# EAGLE design sss (EAGLE 7.3.0)
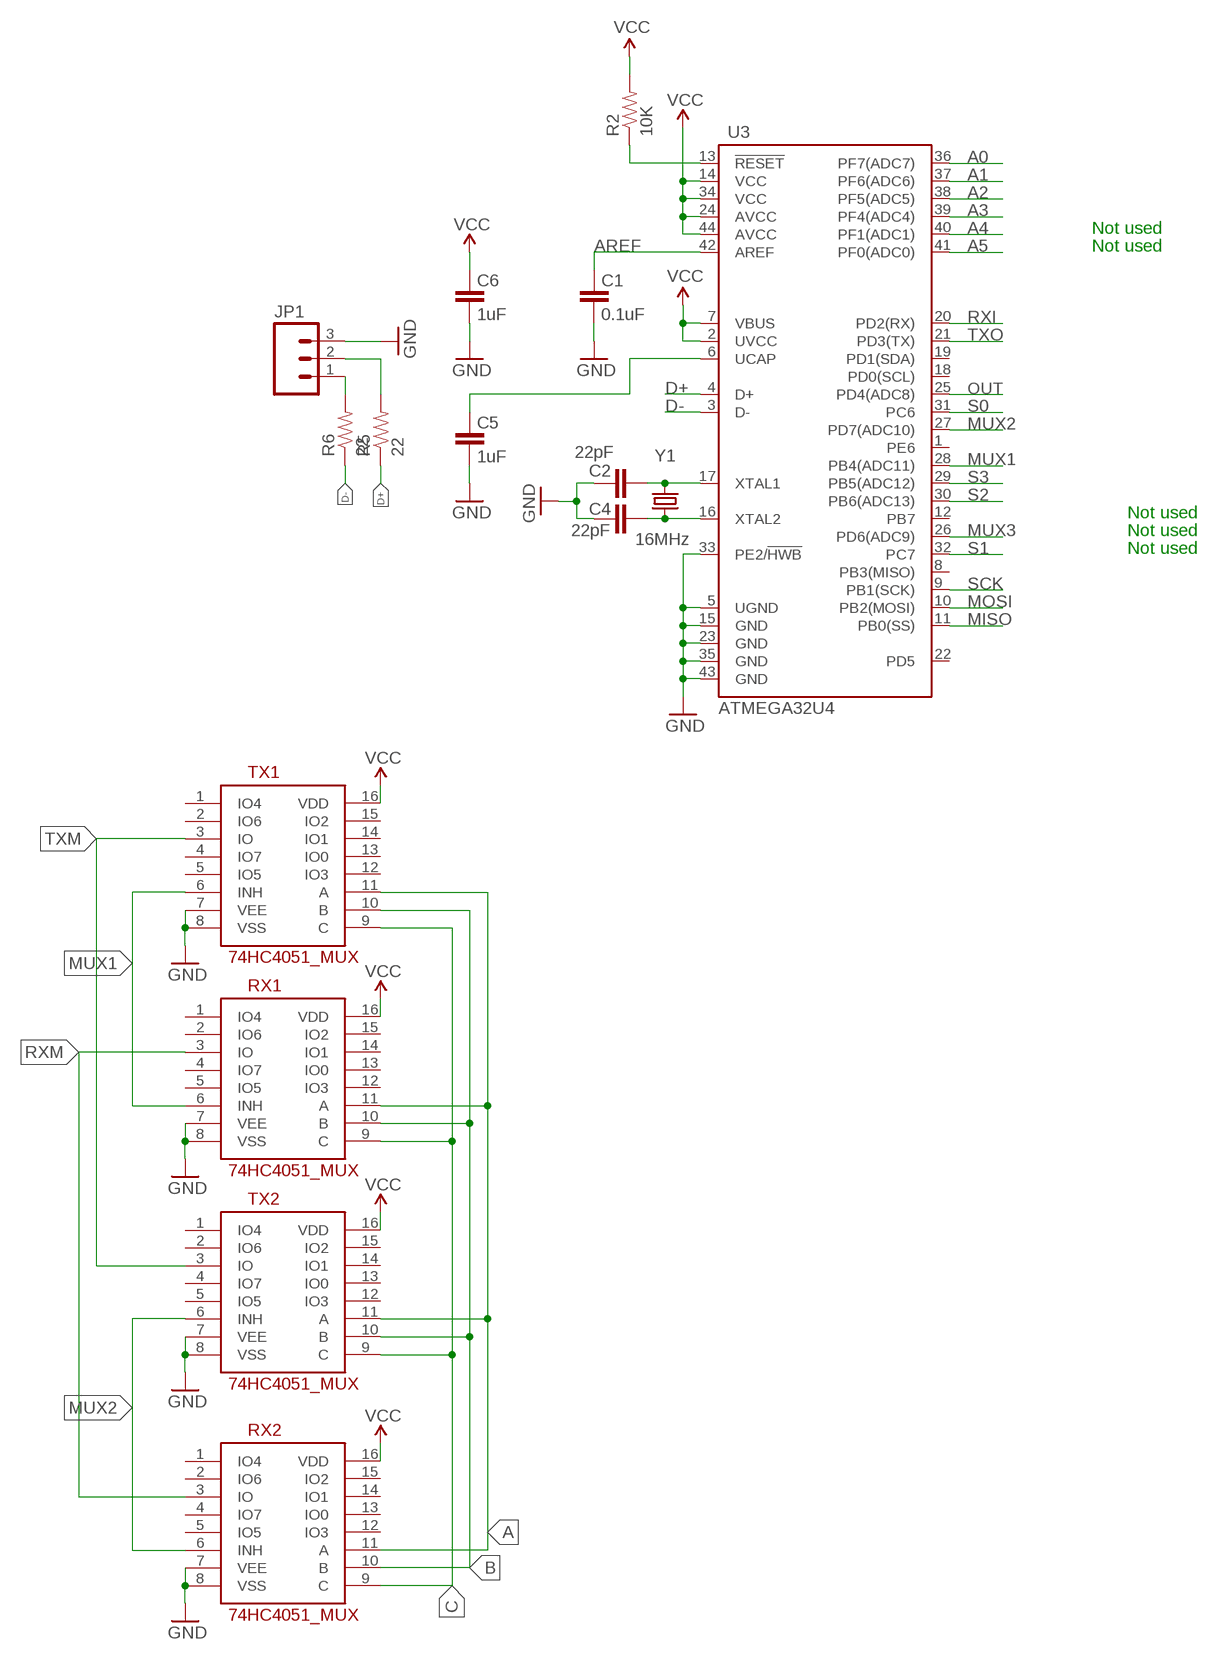
[diagram p0: schematic, sheet 1]

## Parts
C1  0.1uF  CAP0603-CAP  [0603-CAP]
C2  22pF  CAP0603-CAP  [0603-CAP]
C4  22pF  CAP0603-CAP  [0603-CAP]
C5  1uF  CAP0603-CAP  [0603-CAP]
C6  1uF  CAP0603-CAP  [0603-CAP]
JP1  M03PTH  [1X03]
R2  10K  RESISTOR0603-RES  [0603-RES]
R5  22  22OHM1/10W1%(0603)  [0603-RES]
R6  22  22OHM1/10W1%(0603)  [0603-RES]
RX1  74HC4051_MUX  [SO16]
RX2  74HC4051_MUX  [SO16]
TX1  74HC4051_MUX  [SO16]
TX2  74HC4051_MUX  [SO16]
U3  ATMEGA32U4  ATMEGA32U4OUTFAKES  [QFN-44-NOPAD_1:1-OUTFAKES]
Y1  16MHz  CRYSTAL5X3  [CRYSTAL-SMD-5X3]

## Nets
3.3V: C6.2 RX1.16(VDD) RX2.16(VDD) TX1.16(VDD) TX2.16(VDD) ; supply symbol labelled VCC
A: RX1.11(A) RX2.11(A) TX1.11(A) TX2.11(A)
A0: U3.36(PF7(ADC7))
A1: U3.37(PF6(ADC6))
A2: U3.38(PF5(ADC5))
A3: U3.39(PF4(ADC4))
A4: U3.40(PF1(ADC1))
A5: U3.41(PF0(ADC0))
AREF: C1.2 U3.42(AREF)
B: RX1.10(B) RX2.10(B) TX1.10(B) TX2.10(B)
C: RX1.9(C) RX2.9(C) TX1.9(C) TX2.9(C)
D+: R5.1 U3.4(D+)
D-: R6.1 U3.3(D-)
GND [vcc]: C1.1 C2.2 C4.2 C5.1 C6.1 JP1.3 RX1.7(VEE) RX1.8(VSS) RX2.7(VEE) RX2.8(VSS) TX1.7(VEE) TX1.8(VSS) TX2.7(VEE) TX2.8(VSS) U3.5(UGND) U3.15(GND) U3.23(GND) U3.33(PE2/!HWB) U3.35(GND) U3.43(GND)
MISO: U3.11(PB0(SS))
MOSI: U3.10(PB2(MOSI))
MUX1: RX1.6(INH) TX1.6(INH) U3.28(PB4(ADC11))
MUX2: RX2.6(INH) TX2.6(INH) U3.27(PD7(ADC10))
MUX3: U3.26(PD6(ADC9))
N$1: C4.1 U3.16(XTAL2) Y1.1
N$2: C2.1 U3.17(XTAL1) Y1.3
N$4: C5.2 U3.6(UCAP)
N$16: JP1.1 R6.2
N$17: JP1.2 R5.2
OUT: U3.25(PD4(ADC8))
RESET: R2.1 U3.13(!RESET)
RXI: U3.20(PD2(RX))
RXM: RX1.3(IO) RX2.3(IO)
S0: U3.31(PC6)
S1: U3.32(PC7)
S2: U3.30(PB6(ADC13))
S3: U3.29(PB5(ADC12))
SCK: U3.9(PB1(SCK))
TXM: TX1.3(IO) TX2.3(IO)
TXO: U3.21(PD3(TX))
UVCC: U3.2(UVCC) U3.7(VBUS) ; supply symbol labelled VCC
VCC: R2.2 U3.14(VCC) U3.24(AVCC) U3.34(VCC) U3.44(AVCC)
Unconnected: RX1.1(IO4) RX1.2(IO6) RX1.4(IO7) RX1.5(IO5) RX1.12(IO3) RX1.13(IO0) RX1.14(IO1) RX1.15(IO2) RX2.1(IO4) RX2.2(IO6) RX2.4(IO7) RX2.5(IO5) RX2.12(IO3) RX2.13(IO0) RX2.14(IO1) RX2.15(IO2) TX1.1(IO4) TX1.2(IO6) TX1.4(IO7) TX1.5(IO5) TX1.12(IO3) TX1.13(IO0) TX1.14(IO1) TX1.15(IO2) TX2.1(IO4) TX2.2(IO6) TX2.4(IO7) TX2.5(IO5) TX2.12(IO3) TX2.13(IO0) TX2.14(IO1) TX2.15(IO2) U3.1(PE6) U3.8(PB3(MISO)) U3.12(PB7) U3.18(PD0(SCL)) U3.19(PD1(SDA)) U3.22(PD5)

## Notes on the sheet
- Not used
- Not used
- Not used
- Not used
- Not used

## Library data of the parts
C1 C2 C4-C6 = SparkFun:CAP: Capacitor Standard 0603 ceramic capacitor, and 0.1" leaded capacitor.
JP1 = SparkFun:M03: Header 3 Standard 3-pin 0.1" header. Use with straight break away headers (SKU : PRT-00116), right angle break away headers (PRT-00553), swiss pins (PRT-00743), machine pins (PRT-00117), and female headers (PRT-00115). Molex polarized connector foot print use with SKU : PRT-08232 with associated crimp pins and housings.
R2 = SparkFun:RESISTOR: Resistor Basic schematic elements and footprints for 0603, 1206, and PTH resistors.
R5 R6 = SparkFun-Resistors:22OHM1/10W1%(0603): RES-08698; PROD_ID: RES-08698
RX1 RX2 TX1 TX2 = SparkFun-AnalogIC:74HC4051_MUX: 8:1 analog mux
U3 = Testing:ATMEGA32U4: Atmel 44-pin 8-bit Microcontroller with 32KBytes of ISP Flash and USB Controller
Y1 = SparkFun:CRYSTAL: Crystals Various standard crystals. Proven footprints. Spark Fun Electronics SKU : COM-00534

## Board
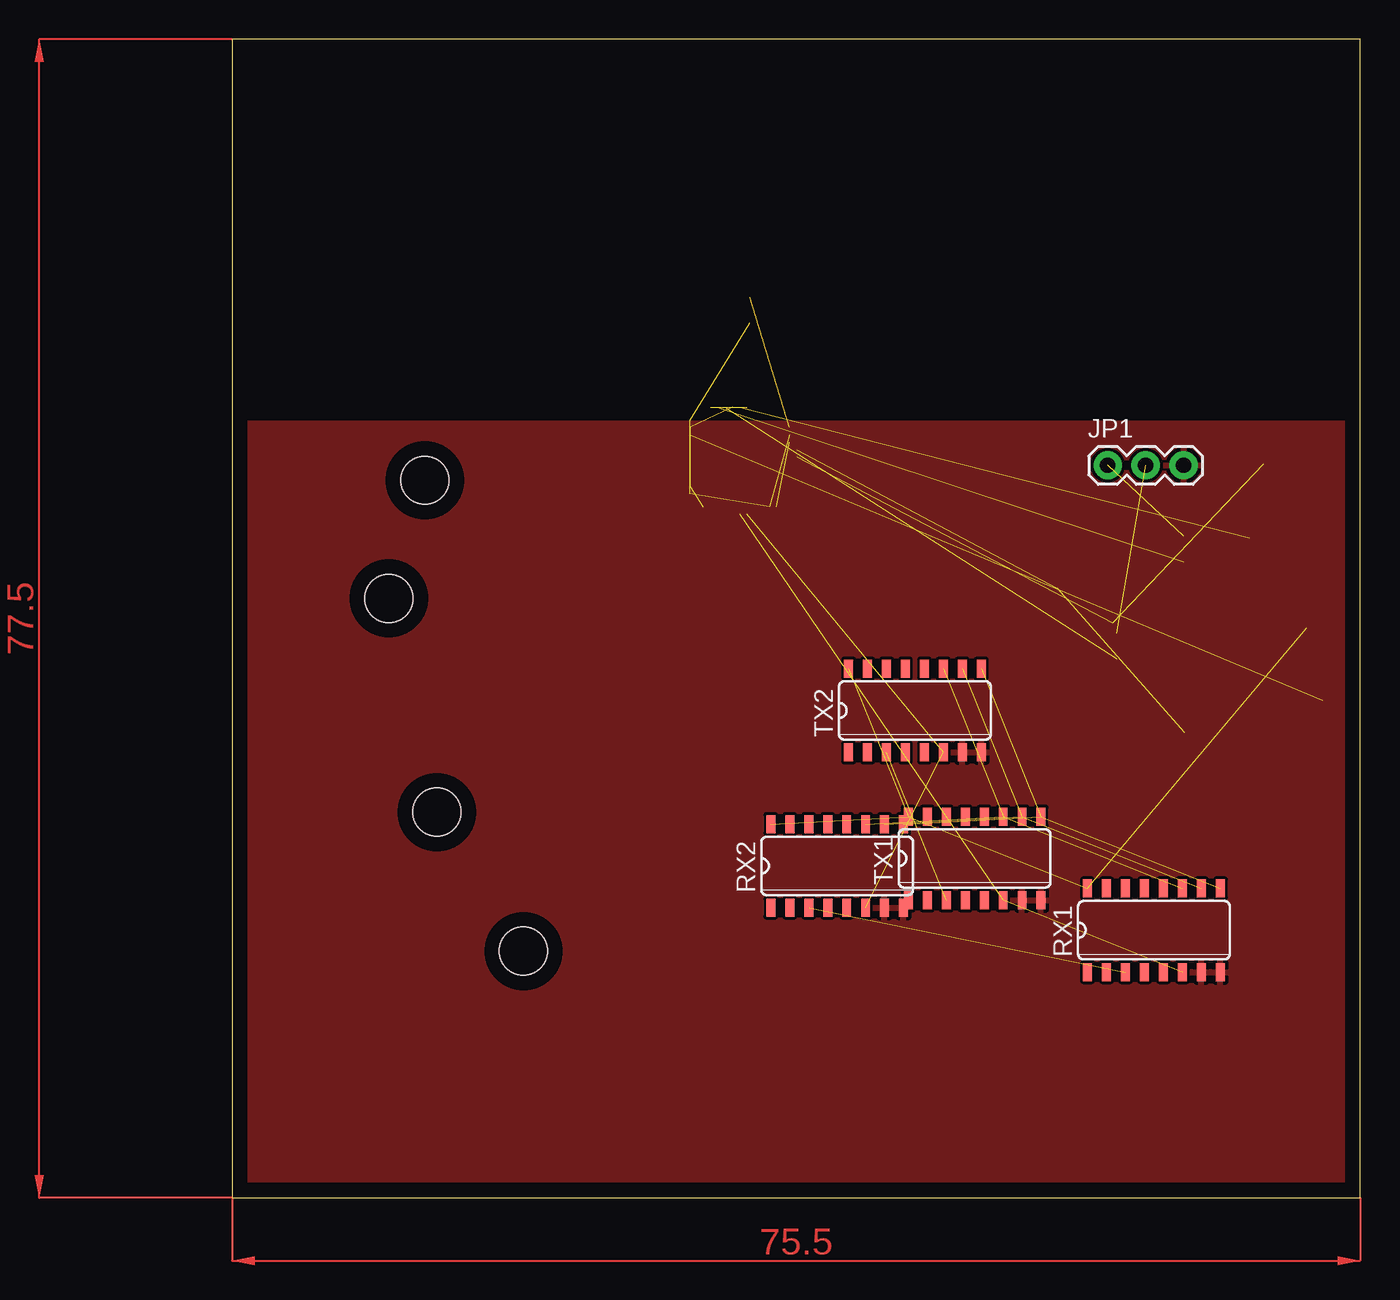
[diagram p1: board, top side]
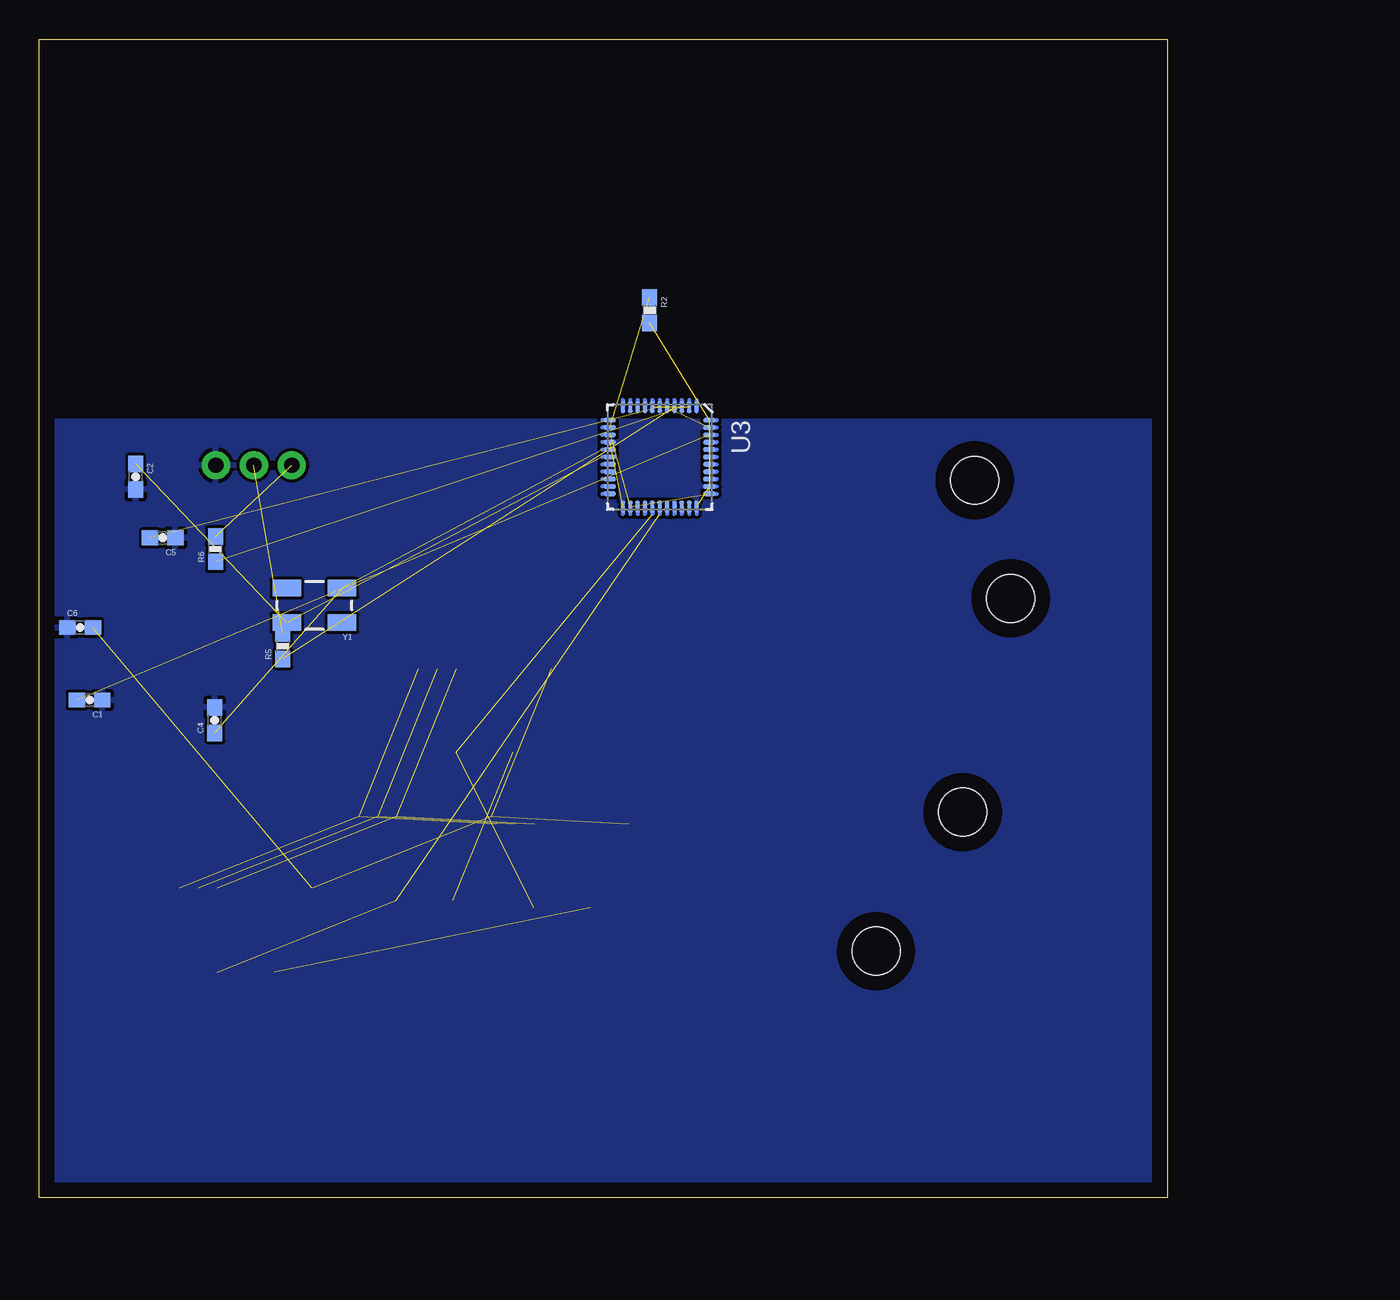
[diagram p2: board, bottom side, seen from below]

Size 75.5 x 77.5 mm. Coordinates in mm from the lower left corner, seen from the top.
Outline: 0,0 75.5,0 75.5,77.5 0,77.5 0,0
Copper layers (1*16): Top 0.035mm / dielectric 1.5mm / Bottom 0.035mm
Design rules "default": minimum track width 10mil, minimum drill 24mil, track to track 8mil, track to pad 8mil, pad to pad 8mil, via to via 8mil, smd to smd 8mil, copper to edge 40mil, drill to drill 8mil, minimum pad ring 10mil, minimum via ring 8mil, stop-mask expansion 4mil, vias tented up to drill 0mil, thermal gap 10mil
Holes 3.2 mm at 12.9,48 10.5,40.1 13.7,25.8 19.5,16.5

### Footprints (pad centres in the part's own frame; a part is rotated, then mirrored left to right if it is on the bottom)
0603-CAP = smd 1.1 x 1: 1 -0.85,0; 2 0.85,0
1X03 = drill 1.016 pad 1.88: 1 0,0; 2 2.54,0; 3 5.08,0
0603-RES = smd 1.1 x 1: 1 -0.85,0; 2 0.85,0
SO16 = smd 0.6 x 1.2: 1 -4.445,-2.8; 2 -3.175,-2.8; 3 -1.905,-2.8; 4 -0.635,-2.8; 5 0.635,-2.8; 6 1.905,-2.8; 7 3.175,-2.8; 8 4.445,-2.8; 9 4.445,2.8; 10 3.175,2.8; 11 1.905,2.8; 12 0.635,2.8; 13 -0.635,2.8; 14 -1.905,2.8; 15 -3.175,2.8; 16 -4.445,2.8
QFN-44-NOPAD_1:1-OUTFAKES = smd 0.8 x 0.3: 1 -3.337,2.465; 2 -3.337,1.972; 3 -3.337,1.479; 4 -3.337,0.986; 5 -3.337,0.493; 6 -3.337,0; 7 -3.337,-0.493; 8 -3.337,-0.986; 9 -3.337,-1.479; 10 -3.337,-1.972; 11 -3.337,-2.465; 23 3.337,-2.465; 24 3.337,-1.972; 25 3.337,-1.479; 26 3.337,-0.986; 27 3.337,-0.493; 28 3.337,0; 29 3.337,0.493; 30 3.337,0.986; 31 3.337,1.479; 32 3.337,1.972; 33 3.337,2.465 | smd 0.3 x 0.8: 12 -2.465,-3.337; 13 -1.972,-3.337; 14 -1.479,-3.337; 15 -0.986,-3.337; 16 -0.493,-3.337; 17 0,-3.337; 18 0.493,-3.337; 19 0.986,-3.337; 20 1.479,-3.337; 21 1.972,-3.337; 22 2.465,-3.337; 34 2.465,3.337; 35 1.972,3.337; 36 1.479,3.337; 37 0.986,3.337; 38 0.493,3.337; 39 0,3.337; 40 -0.493,3.337; 41 -0.986,3.337; 42 -1.479,3.337; 43 -1.972,3.337; 44 -2.465,3.337
CRYSTAL-SMD-5X3 = smd 1.9 x 1.1: 1 -1.85,-1.15; 2 1.85,-1.15; 3 1.85,1.15; 4 -1.85,1.15

### Placement (x,y rotation side)
C1  72.14,33.3 180 bottom
C2  69.05,48.24 270 bottom
C4  63.75,31.95 90 bottom
C5  67.24,44.15 180 bottom
C6  72.77,38.15 0 bottom
JP1  58.6,49 0 top
R2  34.65,59.38 270 bottom
R5  59.2,36.9 90 bottom
R6  63.7,43.4 90 bottom
RX1  61.7,17.9 0 top
RX2  40.5,22.2 0 top
TX1  49.7,22.7 0 top
TX2  45.7,32.6 0 top
U3  33.98,49.56 270 bottom
Y1  57.09,39.63 180 bottom

### Tracks (layer width: path | path; a pad name or v marks a point on that pad's centre or on a via)
3.3V  (4 unrouted)
A  (3 unrouted)
AREF  (1 unrouted)
B  (3 unrouted)
C  (3 unrouted)
D+  (1 unrouted)
D-  (1 unrouted)
GND  (4 unrouted)
  pour Top: 0.5,51.8 116.4,51.8 116.4,0.7 0.5,0.7
  pour Bottom: 0.3,51.9 116.3,51.9 116.3,0.6 0.3,0.6
MUX1  (2 unrouted)
MUX2  (2 unrouted)
N$1  (2 unrouted)
N$2  (2 unrouted)
N$4  (1 unrouted)
N$16  (1 unrouted)
N$17  (1 unrouted)
RESET  (1 unrouted)
RXM  (1 unrouted)
TXM  (1 unrouted)
UVCC  (1 unrouted)
VCC  (4 unrouted)
(copper drawn outside any net)
  shapes: Top area x2